# Altium schematic sheet Voltage regulator.SchDoc
size A4
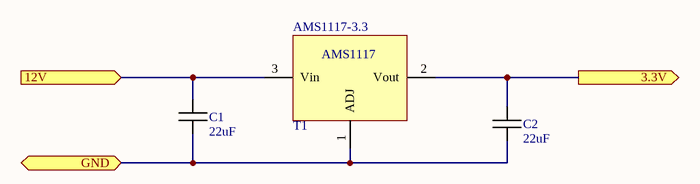
[diagram p0: Voltage regulator.SchDoc]

## Parts
AMS1117-3.3  T1  [SOT-223]
C1  22uF  [0805-C]
C2  22uF  [0805-C]

## Ports
3.3V (out), 12V (in), GND

## Nets
3.3V: AMS1117-3.3.2(Vout) C2.2 ; port 3.3V
12V: AMS1117-3.3.3(Vin) C1.2 ; port 12V
GND: AMS1117-3.3.1(ADJ) C1.1 C2.1 ; port GND

## Library data of the parts
AMS1117-3.3 = AMS1117
C1 C2 = Capacitor